# EAGLE design fhd-hdr (EAGLE 9.6.2)
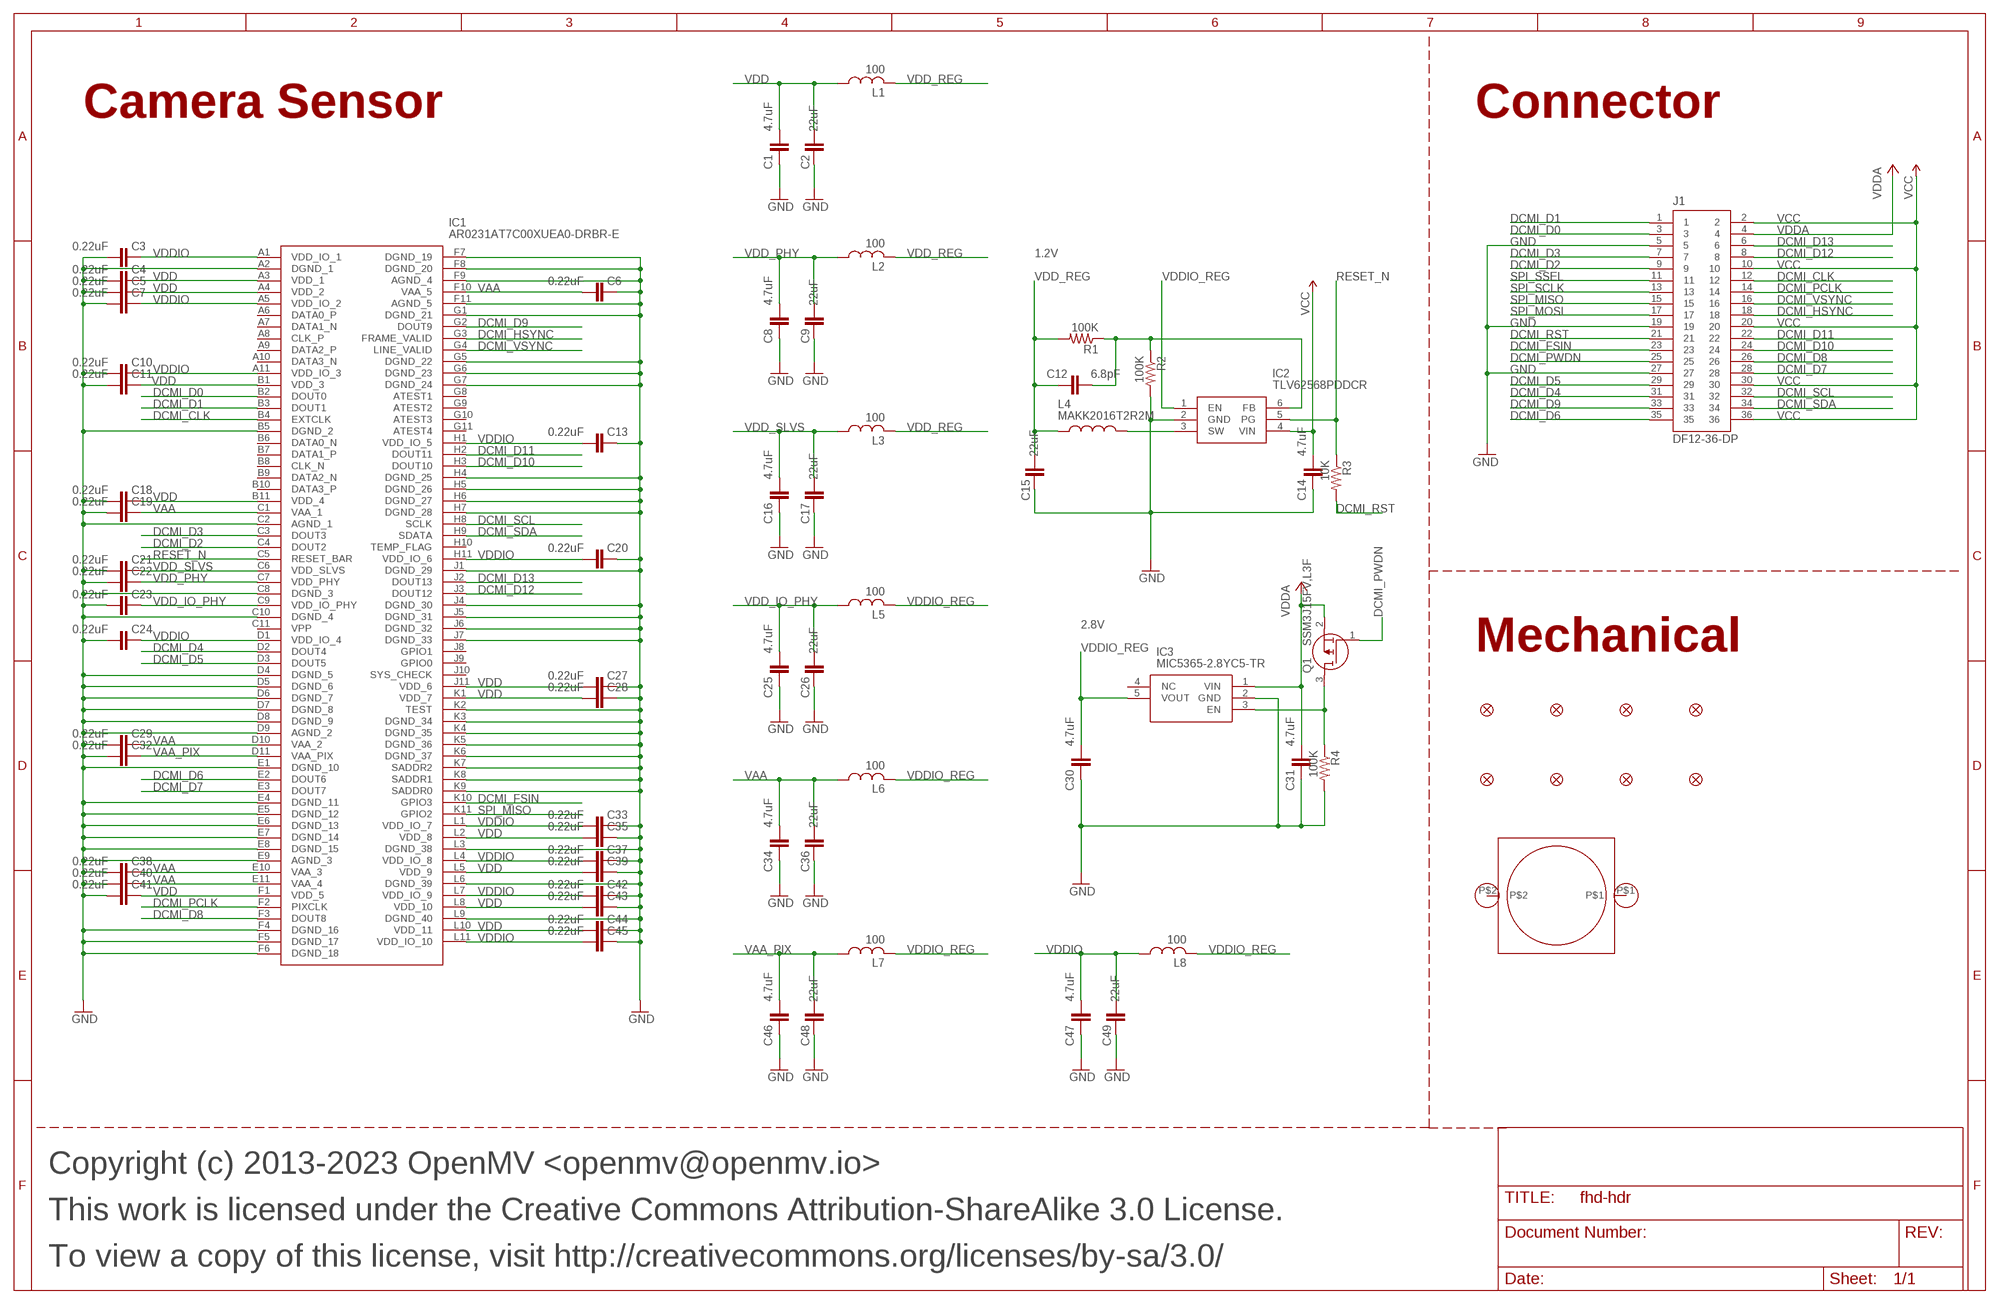
[diagram p0: schematic, sheet 1]

## Parts
C1  4.7uF  CAP_0402  [0402]
C2  22uF  22UF-0805-6.3V-20%  [0805]
C3  0.22uF  C-EUC0201  [C0201]
C4  0.22uF  C-EUC0201  [C0201]
C5  0.22uF  C-EUC0201  [C0201]
C6  0.22uF  C-EUC0201  [C0201]
C7  0.22uF  C-EUC0201  [C0201]
C8  4.7uF  CAP_0402  [0402]
C9  22uF  22UF-0805-6.3V-20%  [0805]
C10  0.22uF  C-EUC0201  [C0201]
C11  0.22uF  C-EUC0201  [C0201]
C12  6.8pF  CAP_0402  [0402]
C13  0.22uF  C-EUC0201  [C0201]
C14  4.7uF  CAP_0402  [0402]
C15  22uF  22UF-0805-6.3V-20%  [0805]
C16  4.7uF  CAP_0402  [0402]
C17  22uF  22UF-0805-6.3V-20%  [0805]
C18  0.22uF  C-EUC0201  [C0201]
C19  0.22uF  C-EUC0201  [C0201]
C20  0.22uF  C-EUC0201  [C0201]
C21  0.22uF  C-EUC0201  [C0201]
C22  0.22uF  C-EUC0201  [C0201]
C23  0.22uF  C-EUC0201  [C0201]
C24  0.22uF  C-EUC0201  [C0201]
C25  4.7uF  CAP_0402  [0402]
C26  22uF  22UF-0805-6.3V-20%  [0805]
C27  0.22uF  C-EUC0201  [C0201]
C28  0.22uF  C-EUC0201  [C0201]
C29  0.22uF  C-EUC0201  [C0201]
C30  4.7uF  CAP_0402  [0402]
C31  4.7uF  CAP_0402  [0402]
C32  0.22uF  C-EUC0201  [C0201]
C33  0.22uF  C-EUC0201  [C0201]
C34  4.7uF  CAP_0402  [0402]
C35  0.22uF  C-EUC0201  [C0201]
C36  22uF  22UF-0805-6.3V-20%  [0805]
C37  0.22uF  C-EUC0201  [C0201]
C38  0.22uF  C-EUC0201  [C0201]
C39  0.22uF  C-EUC0201  [C0201]
C40  0.22uF  C-EUC0201  [C0201]
C41  0.22uF  C-EUC0201  [C0201]
C42  0.22uF  C-EUC0201  [C0201]
C43  0.22uF  C-EUC0201  [C0201]
C44  0.22uF  C-EUC0201  [C0201]
C45  0.22uF  C-EUC0201  [C0201]
C46  4.7uF  CAP_0402  [0402]
C47  4.7uF  CAP_0402  [0402]
C48  22uF  22UF-0805-6.3V-20%  [0805]
C49  22uF  22UF-0805-6.3V-20%  [0805]
FD1  FIDUCIAL1X2  [FIDUCIAL-1X2]
FD2  FIDUCIAL1X2  [FIDUCIAL-1X2]
FD3  FIDUCIAL1X2  [FIDUCIAL-1X2]
FD4  FIDUCIAL1X2  [FIDUCIAL-1X2]
FD5  FIDUCIAL1X2  [FIDUCIAL-1X2]
FD6  FIDUCIAL1X2  [FIDUCIAL-1X2]
FD7  FIDUCIAL1X2  [FIDUCIAL-1X2]
FD8  FIDUCIAL1X2  [FIDUCIAL-1X2]
H1  LENSMOUNT20MM  [LENSMOUNT-20MM]
IC1  AR0231AT7C00XUEA0-DRBR-E  [BGA121C80P11X11_1100X1000X155]
IC2  TLV62568PDDCR  [SOT95P280X110-6N]
IC3  MIC5365-2.8YC5-TR  [SOT65P210X110-5N]
J1  DF12-36-DP  [DF12-36-DP]
L1  100  INDUCTOR_0402  [0402]
L2  100  INDUCTOR_0402  [0402]
L3  100  INDUCTOR_0402  [0402]
L4  MAKK2016T2R2M  [INDC2016X100N]
L5  100  INDUCTOR_0402  [0402]
L6  100  INDUCTOR_0402  [0402]
L7  100  INDUCTOR_0402  [0402]
L8  100  INDUCTOR_0402  [0402]
Q1  SSM3J15FV,L3F  [SSM3J15FVL3F]
R1  100K  R-US_R0402  [R0402]
R2  100K  R-US_R0402  [R0402]
R3  10K  R-US_R0402  [R0402]
R4  100K  R-US_R0402  [R0402]

## Nets
DCMI_CLK [signal]: IC1.B4(EXTCLK) J1.12
DCMI_D0 [signal]: IC1.B2(DOUT0) J1.3
DCMI_D1 [signal]: IC1.B3(DOUT1) J1.1
DCMI_D2 [signal]: IC1.C4(DOUT2) J1.9
DCMI_D3 [signal]: IC1.C3(DOUT3) J1.7
DCMI_D4 [signal]: IC1.D2(DOUT4) J1.31
DCMI_D5 [signal]: IC1.D3(DOUT5) J1.29
DCMI_D6 [signal]: IC1.E2(DOUT6) J1.35
DCMI_D7 [signal]: IC1.E3(DOUT7) J1.28
DCMI_D8 [signal]: IC1.F3(DOUT8) J1.26
DCMI_D9 [signal]: IC1.G2(DOUT9) J1.33
DCMI_D10 [signal]: IC1.H3(DOUT10) J1.24
DCMI_D11 [signal]: IC1.H2(DOUT11) J1.22
DCMI_D12 [signal]: IC1.J3(DOUT12) J1.8
DCMI_D13 [signal]: IC1.J2(DOUT13) J1.6
DCMI_FSIN [signal]: IC1.K10(GPIO3) J1.23
DCMI_HSYNC [signal]: IC1.G3(FRAME_VALID) J1.18
DCMI_PCLK [signal]: IC1.F2(PIXCLK) J1.14
DCMI_PWDN [signal]: J1.25 Q1.1(G)
DCMI_PWDN_INT [signal]: IC3.3(EN) Q1.3(D) R4.1
DCMI_RST [signal]: J1.21 R3.2
DCMI_SCL [signal]: IC1.H8(SCLK) J1.32
DCMI_SDA [signal]: IC1.H9(SDATA) J1.34
DCMI_VSYNC [signal]: IC1.G4(LINE_VALID) J1.16
FB [pwr]: C12.2 IC2.6(FB) R1.1 R2.1
GND [gnd]: C1.1 C2.1 C3.2 C4.2 C5.2 C6.1 C7.2 C8.1 C9.1 C10.2 C11.2 C13.1 C14.1 C15.1 C16.1 C17.1 C18.2 C19.2 C20.1 C21.2 C22.2 C23.2 C24.2 C25.1 C26.1 C27.1 C28.1 C29.2 C30.1 C31.1 C32.2 C33.1 C34.1 C35.1 C36.1 C37.1 C38.2 C39.1 C40.2 C41.2 C42.1 C43.1 C44.1 C45.1 C46.1 C47.1 C48.1 C49.1 IC1.A2(DGND_1) IC1.B5(DGND_2) IC1.C2(AGND_1) IC1.C8(DGND_3) IC1.C10(DGND_4) IC1.D4(DGND_5) IC1.D5(DGND_6) IC1.D6(DGND_7) IC1.D7(DGND_8) IC1.D8(DGND_9) IC1.D9(AGND_2) IC1.E1(DGND_10) IC1.E4(DGND_11) IC1.E5(DGND_12) IC1.E6(DGND_13) IC1.E7(DGND_14) IC1.E8(DGND_15) IC1.E9(AGND_3) IC1.F4(DGND_16) IC1.F5(DGND_17) IC1.F6(DGND_18) IC1.F7(DGND_19) IC1.F8(DGND_20) IC1.F9(AGND_4) IC1.F11(AGND_5) IC1.G1(DGND_21) IC1.G5(DGND_22) IC1.G6(DGND_23) IC1.G7(DGND_24) IC1.H4(DGND_25) IC1.H5(DGND_26) IC1.H6(DGND_27) IC1.H7(DGND_28) IC1.J1(DGND_29) IC1.J4(DGND_30) IC1.J5(DGND_31) IC1.J6(DGND_32) IC1.J7(DGND_33) IC1.K2(TEST) IC1.K3(DGND_34) IC1.K4(DGND_35) IC1.K5(DGND_36) IC1.K6(DGND_37) IC1.K7(SADDR2) IC1.K8(SADDR1) IC1.K9(SADDR0) IC1.L3(DGND_38) IC1.L6(DGND_39) IC1.L9(DGND_40) IC2.2(GND) IC3.2(GND) J1.5 J1.19 J1.27 R2.2 R4.2
RESET_N [signal]: IC1.C5(RESET_BAR) IC2.5(PG) R3.1
SPI_MISO [signal]: IC1.K11(GPIO2) J1.15
SPI_MOSI [signal]: J1.17
SPI_SCLK [signal]: J1.13
SPI_SSEL [signal]: J1.11
SW [pwr]: IC2.3(SW) L4.2
VAA [pwr]: C6.2 C19.1 C29.1 C34.2 C36.2 C38.1 C40.1 IC1.C1(VAA_1) IC1.D10(VAA_2) IC1.E10(VAA_3) IC1.E11(VAA_4) IC1.F10(VAA_5) L6.1
VAA_PIX [pwr]: C32.1 C46.2 C48.2 IC1.D11(VAA_PIX) L7.1
VCC [pwr]: C14.2 IC2.4(VIN) J1.2 J1.10 J1.20 J1.30 J1.36
VDD [pwr]: C1.2 C2.2 C4.1 C5.1 C11.1 C18.1 C27.2 C28.2 C35.2 C39.2 C41.1 C43.2 C44.2 IC1.A3(VDD_1) IC1.A4(VDD_2) IC1.B1(VDD_3) IC1.B11(VDD_4) IC1.F1(VDD_5) IC1.J11(VDD_6) IC1.K1(VDD_7) IC1.L2(VDD_8) IC1.L5(VDD_9) IC1.L8(VDD_10) IC1.L10(VDD_11) L1.1
VDD_IO_PHY [pwr]: C23.1 C25.2 C26.2 IC1.C9(VDD_IO_PHY) L5.1
VDD_PHY [pwr]: C8.2 C9.2 C22.1 IC1.C7(VDD_PHY) L2.1
VDD_REG [pwr]: C12.1 C15.2 L1.2 L2.2 L3.2 L4.1 R1.2
VDD_SLVS [pwr]: C16.2 C17.2 C21.1 IC1.C6(VDD_SLVS) L3.1
VDDA [pwr]: C31.2 IC3.1(VIN) J1.4 Q1.2(S)
VDDIO [pwr]: C3.1 C7.1 C10.1 C13.2 C20.2 C24.1 C33.2 C37.2 C42.2 C45.2 C47.2 C49.2 IC1.A1(VDD_IO_1) IC1.A5(VDD_IO_2) IC1.A11(VDD_IO_3) IC1.D1(VDD_IO_4) IC1.H1(VDD_IO_5) IC1.H11(VDD_IO_6) IC1.L1(VDD_IO_7) IC1.L4(VDD_IO_8) IC1.L7(VDD_IO_9) IC1.L11(VDD_IO_10) L8.1
VDDIO_REG [pwr]: C30.2 IC2.1(EN) IC3.5(VOUT) L5.2 L6.2 L7.2 L8.2
Unconnected: H1.P$1 H1.P$2 IC1.A6(DATA0_P) IC1.A7(DATA1_N) IC1.A8(CLK_P) IC1.A9(DATA2_P) IC1.A10(DATA3_N) IC1.B6(DATA0_N) IC1.B7(DATA1_P) IC1.B8(CLK_N) IC1.B9(DATA2_N) IC1.B10(DATA3_P) IC1.C11(VPP) IC1.G8(ATEST1) IC1.G9(ATEST2) IC1.G10(ATEST3) IC1.G11(ATEST4) IC1.H10(TEMP_FLAG) IC1.J8(GPIO1) IC1.J9(GPIO0) IC1.J10(SYS_CHECK) IC3.4(NC)

## Notes on the sheet
- Camera Sensor | Connector
- 1.2V
- 2.8V
- Mechanical
- Copyright (c) 2013-2023 OpenMV <openmv@openmv.io>
- This work is licensed under the Creative Commons Attribution-ShareAlike 3.0 License.
- To view a copy of this license, visit http://creativecommons.org/licenses/by-sa/3.0/

## Library data of the parts
C1 C8 C14 C16 C25 C30 C31 C34 C46 C47 = 0402:CAP_0402: 0402 (1005 Metric) Nick Garner - TeleSense; MPN: JMK105BBJ475MV-F
C2 C9 C15 C17 C26 C36 C48 C49 = SparkFun-Capacitors:22UF: 22µF ceramic capacitors A capacitor is a passive two-terminal electrical component used to store electrical energy temporarily in an electric field.; MPN: CL21A226MQQNNNE; PROD_ID: CAP-08402
C3-C7 C10 C11 C13 C18-C24 C27-C29 C32 C33 C35 C37-C45 = rcl:C-EU: CAPACITOR, European symbol; MPN: GRM033R60J224ME15D; SPICEPREFIX: C
C12 = 0402:CAP_0402: 0402 (1005 Metric) Nick Garner - TeleSense; MPN: GRM1555C1H6R8DA01D
FD1-FD8 = SparkFun-Aesthetics:FIDUCIAL: Fiducial Alignment Points Point-of-reference for pick-and-place machines and other optical instruments.
H1 = lensmount:LENSMOUNT
IC1 = AR0231AT7C00XUEA0-DRBR-E:AR0231AT7C00XUEA0-DRBR-E: Image Sensor Color CMOS 1928 x 1208Pixels Source: Datasheet <https://4donline.ihs.com/images/VipMasterIC/IC/ONSM/ONSM-S-A0003590094/ONSM-S-A0003590376-1.pdf?hkey=52A5661711E402568146F3353EA87419>; DESCRIPTION: Image Sensor Color CMOS 1928 x 1208Pixels; HEIGHT: 1.55mm; MANUFACTURER_NAME: onsemi; MANUFACTURER_PART_NUMBER: AR0231AT7C00XUEA0-DRBR-E; MPN: AR0231AT7C00XUEA0-DPBR
IC2 = TLV62568PDDCR:TLV62568PDDCR: 2.5V-5.5V input, 1A high efficiency step-down buck converter in SOT23 and SOT563 package Source: Datasheet <http://www.ti.com/lit/gpn/tlv62568>; DESCRIPTION: 2.5V-5.5V input, 1A high efficiency step-down buck converter in SOT23 and SOT563 package; HEIGHT: 1.1mm; MANUFACTURER_NAME: Texas Instruments; MANUFACTURER_PART_NUMBER: TLV62568PDDCR; MOUSER_PART_NUMBER: 595-TLV62568PDDCR; MOUSER_PRICE-STOCK: https://www.mouser.co.uk/ProductDetail/Texas-Instruments/TLV62568PDDCR?qs=1mbolxNpo8f1FPchIXcxyQ%3D%3D; MPN: TLV62568PDDCR
IC3 = MIC5365-2.8YC5-TR:MIC5365-2.8YC5-TR: IC REG LINEAR 2.8V 150MA SC70-5 Source: Datasheet <http://www.microchip.com/mymicrochip/filehandler.aspx?ddocname=en580022>; DESCRIPTION: IC REG LINEAR 2.8V 150MA SC70-5; HEIGHT: 1.1mm; MANUFACTURER_NAME: Microchip; MANUFACTURER_PART_NUMBER: MIC5365-2.8YC5-TR; MOUSER_PART_NUMBER: 998-MIC5365-2.8YC5TR; MOUSER_PRICE-STOCK: https://www.mouser.co.uk/ProductDetail/Microchip-Technology-Atmel/MIC5365-2.8YC5-TR?qs=U6T8BxXiZAX3mJDSWJyjVA%3D%3D; MPN: MIC5365-2.8YC5-TR
J1 = DF12NB(3.0)-36DP-0.5V(51):DF12-36-DP; MPN: DF12NB(3.0)-36DP-0.5V(51)
L1-L3 L5-L8 = 0402:INDUCTOR_0402; MPN: MFBM1V1005-101-R
L4 = MAKK2016T2R2M:MAKK2016T2R2M: INDUCTOR, METAL CORE Check availability <https://pricing.snapeda.com/parts/MAKK2016T2R2M/Taiyo%20Yuden/view-part?ref=eda>; AVAILABILITY: In Stock; DESCRIPTION: 2.2 µH Shielded Drum Core, Wirewound Inductor 1.5 A 160mOhm Max 0806 (2016 Metric); MF: Taiyo Yuden; MP: MAKK2016T2R2M; MPN: MAKK2016T2R2M; PACKAGE: 2016 Taiyo Yuden; PRICE: None; PURCHASE-URL: https://pricing.snapeda.com/search/part/MAKK2016T2R2M/?ref=eda
Q1 = SSM3J15FV_L3F:SSM3J15FV,L3F: MOSFET Small-signal MOSFET High Speed Switching Source: Datasheet <https://toshiba.semicon-storage.com/info/docget.jsp?did=593&prodName=SSM3J15FV>; DESCRIPTION: MOSFET Small-signal MOSFET High Speed Switching; HEIGHT: 0.55mm; MANUFACTURER_NAME: Toshiba; MANUFACTURER_PART_NUMBER: SSM3J15FV,L3F; MOUSER_PART_NUMBER: 757-SSM3J15FVL3F; MOUSER_PRICE-STOCK: https://www.mouser.co.uk/ProductDetail/Toshiba/SSM3J15FVL3F?qs=PDgMCp4xDJb4qTgE7FAUzA%3D%3D; MPN: SSM3J15FV,L3F
R1 R2 R4 = rcl:R-US_: RESISTOR, American symbol; MPN: AC0402FR-07100KL; SPICEPREFIX: R
R3 = rcl:R-US_: RESISTOR, American symbol; MPN: AC0402FR-1310KL; SPICEPREFIX: R

## Net classes
0 default: width 0.076 mm, drill 0.102 mm, clearance 0.076 mm
2 gnd: width 0.076 mm, drill 0.102 mm, clearance 0.076 mm to class 0, clearance 0.076 mm to class 1, clearance 0.127 mm
3 pwr: width 0.076 mm, drill 0.102 mm, clearance 0.076 mm to class 0, clearance 0.076 mm to class 1, clearance 0.076 mm to class 2, clearance 0.127 mm
4 signal: width 0.076 mm, drill 0.102 mm, clearance 0.076 mm to class 0, clearance 0.076 mm to class 1, clearance 0.076 mm to class 2, clearance 0.076 mm to class 3, clearance 0.127 mm

## Board
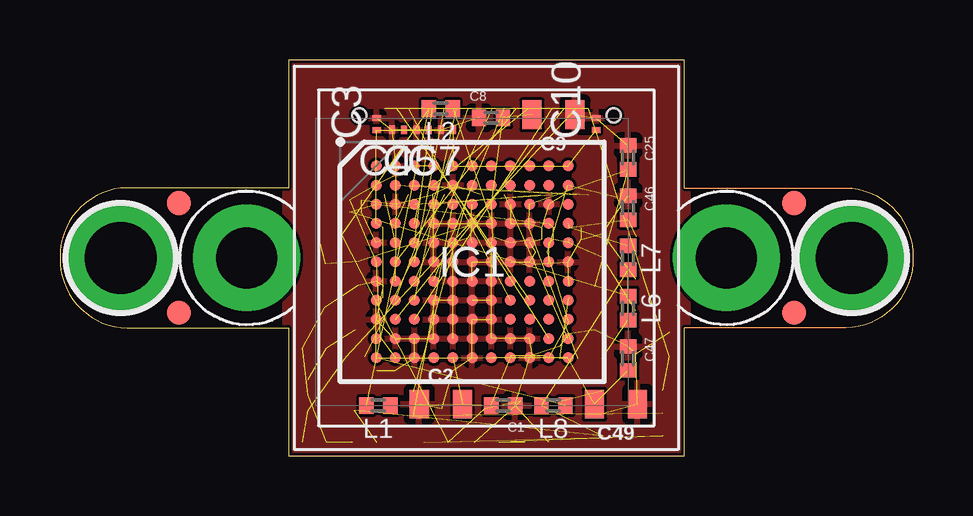
[diagram p1: board, top side]
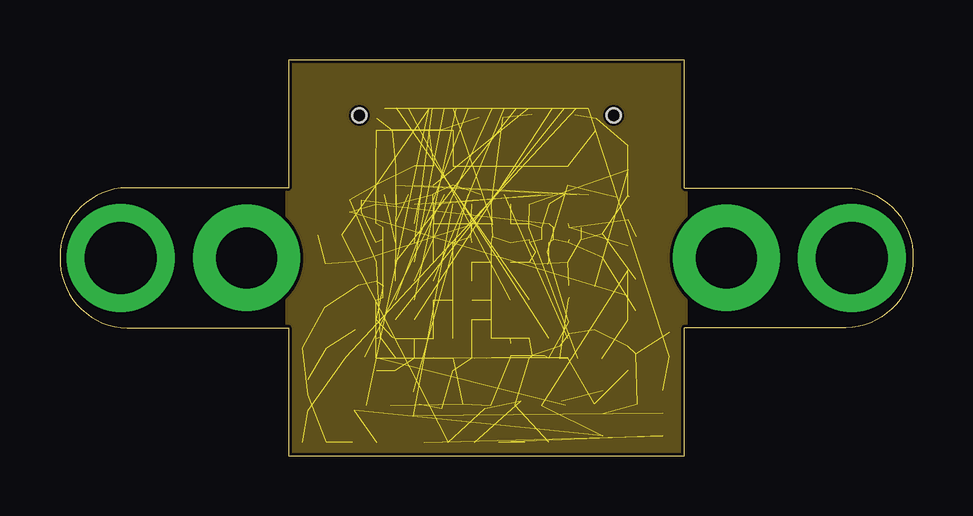
[diagram p2: board, inner layer GND]
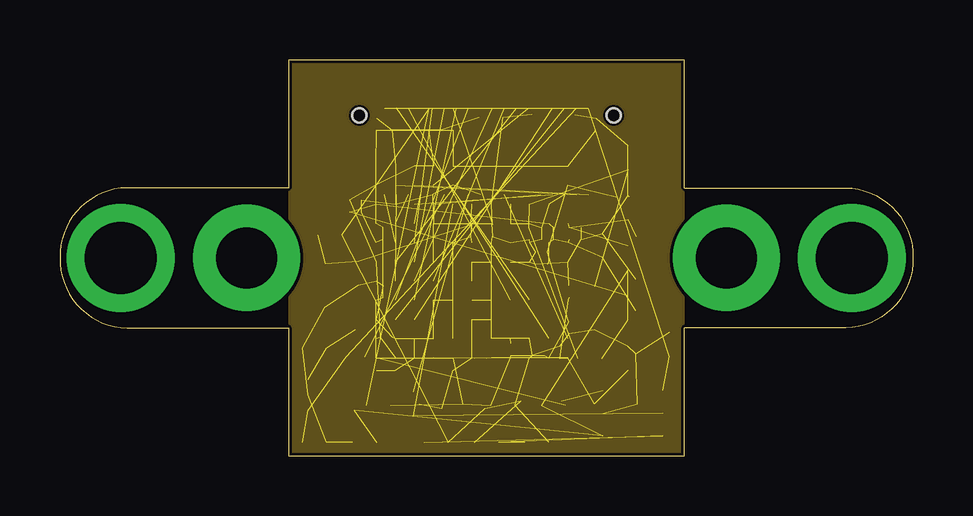
[diagram p3: board, inner layer VCC]
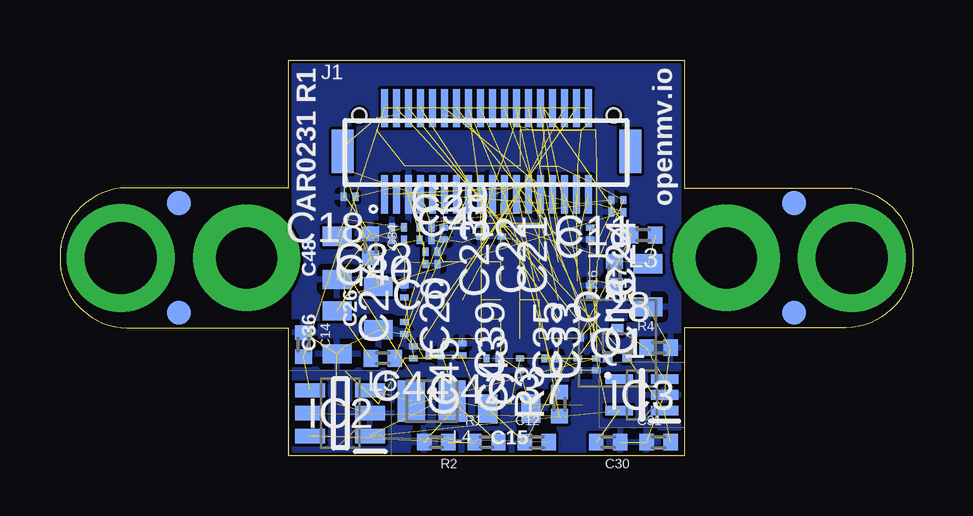
[diagram p4: board, bottom side, seen from below]

Size 35.56 x 16.51 mm. Coordinates in mm from the lower left corner, seen from the top.
Outline: 9.53,16.51 9.53,11.18 2.79,11.18 arc90 0,8.26 arc90 2.79,5.33 9.53,5.33 9.53,0 26.04,0 26.04,5.33 32.77,5.33 arc90 35.56,8.26 arc90 32.77,11.18 26.04,11.18 26.04,16.51 9.53,16.51
Copper layers (1*2*3*14*15*16): Top 0.035mm / dielectric 0.23mm / GND 0.035mm / dielectric 0.38mm / Route3 0.035mm / dielectric 0.15mm / Route14 0.035mm / dielectric 0.38mm / VCC 0.035mm / dielectric 0.23mm / Bottom 0.035mm
Design rules "MF_Ext_4_mil_drill_6_Layer": minimum track width 3mil, minimum drill 4mil, track to track 3mil, track to pad 3mil, pad to pad 3mil, via to via 3mil, smd to smd 0mil, copper to edge 3mil, drill to drill 3mil, minimum pad ring 3mil, minimum via ring 3mil, stop-mask expansion 2mil, vias tented up to drill 25mil, thermal gap 10mil
tKeepout: area 9.5,15.3 to 26,16.5; area 9.5,0 to 10.7,16.5; area 9.5,0 to 26,1.2; area 24.8,0 to 26,16.5

### Footprints (pad centres in the part's own frame; a part is rotated, then mirrored left to right if it is on the bottom)
0402 = smd 0.6 x 0.7: 1 -0.5,0; 2 0.5,0
0805 = smd 0.8 x 1.2: 1 -0.9,0; 2 0.9,0
C0201 = smd 0.25 x 0.35: 1 -0.25,0; 2 0.25,0
FIDUCIAL-1X2 = smd 1 x 1: 1 0,0
LENSMOUNT-20MM = drill 2.54 pad 4.445: P$1 -10,0; P$2 10,0
BGA121C80P11X11_1100X1000X155 = smd 0.45 x 0.45: A1 -4,4; A2 -3.2,4; A3 -2.4,4; A4 -1.6,4; A5 -0.8,4; A6 0,4; A7 0.8,4; A8 1.6,4; A9 2.4,4; A10 3.2,4; A11 4,4; B1 -4,3.2; B2 -3.2,3.2; B3 -2.4,3.2; B4 -1.6,3.2; B5 -0.8,3.2; B6 0,3.2; B7 0.8,3.2; B8 1.6,3.2; B9 2.4,3.2; B10 3.2,3.2; B11 4,3.2; C1 -4,2.4; C2 -3.2,2.4; C3 -2.4,2.4; C4 -1.6,2.4; C5 -0.8,2.4; C6 0,2.4; C7 0.8,2.4; C8 1.6,2.4; C9 2.4,2.4; C10 3.2,2.4; C11 4,2.4; D1 -4,1.6; D2 -3.2,1.6; D3 -2.4,1.6; D4 -1.6,1.6; D5 -0.8,1.6; D6 0,1.6; D7 0.8,1.6; D8 1.6,1.6; D9 2.4,1.6; D10 3.2,1.6; D11 4,1.6; E1 -4,0.8; E2 -3.2,0.8; E3 -2.4,0.8; E4 -1.6,0.8; E5 -0.8,0.8; E6 0,0.8; E7 0.8,0.8; E8 1.6,0.8; E9 2.4,0.8; E10 3.2,0.8; E11 4,0.8; F1 -4,0; F2 -3.2,0; F3 -2.4,0; F4 -1.6,0; F5 -0.8,0; F6 0,0; F7 0.8,0; F8 1.6,0; F9 2.4,0; F10 3.2,0; F11 4,0; G1 -4,-0.8; G2 -3.2,-0.8; G3 -2.4,-0.8; G4 -1.6,-0.8; G5 -0.8,-0.8; G6 0,-0.8; G7 0.8,-0.8; G8 1.6,-0.8; G9 2.4,-0.8; G10 3.2,-0.8; G11 4,-0.8; H1 -4,-1.6; H2 -3.2,-1.6; H3 -2.4,-1.6; H4 -1.6,-1.6; H5 -0.8,-1.6; H6 0,-1.6; H7 0.8,-1.6; H8 1.6,-1.6; H9 2.4,-1.6; H10 3.2,-1.6; H11 4,-1.6; J1 -4,-2.4; J2 -3.2,-2.4; J3 -2.4,-2.4; J4 -1.6,-2.4; J5 -0.8,-2.4; J6 0,-2.4; J7 0.8,-2.4; J8 1.6,-2.4; J9 2.4,-2.4; J10 3.2,-2.4; J11 4,-2.4; K1 -4,-3.2; K2 -3.2,-3.2; K3 -2.4,-3.2; K4 -1.6,-3.2; K5 -0.8,-3.2; K6 0,-3.2; K7 0.8,-3.2; K8 1.6,-3.2; K9 2.4,-3.2; K10 3.2,-3.2; K11 4,-3.2; L1 -4,-4; L2 -3.2,-4; L3 -2.4,-4; L4 -1.6,-4; L5 -0.8,-4; L6 0,-4; L7 0.8,-4; L8 1.6,-4; L9 2.4,-4; L10 3.2,-4; L11 4,-4
SOT95P280X110-6N = smd 1.25 x 0.6: 1 -1.25,0.95; 2 -1.25,0; 3 -1.25,-0.95; 4 1.25,-0.95; 5 1.25,0; 6 1.25,0.95
SOT65P210X110-5N = smd 1.15 x 0.4: 1 -0.95,0.65; 2 -0.95,0; 3 -0.95,-0.65; 4 0.95,-0.65; 5 0.95,0.65
DF12-36-DP = smd 0.3 x 1.6: 1 -4.25,-1.8; 2 -4.25,1.8; 3 -3.75,-1.8; 4 -3.75,1.8; 5 -3.25,-1.8; 6 -3.25,1.8; 7 -2.75,-1.8; 8 -2.75,1.8; 9 -2.25,-1.8; 10 -2.25,1.8; 11 -1.75,-1.8; 12 -1.75,1.8; 13 -1.25,-1.8; 14 -1.25,1.8; 15 -0.75,-1.8; 16 -0.75,1.8; 17 -0.25,-1.8; 18 -0.25,1.8; 19 0.25,-1.8; 20 0.25,1.8; 21 0.75,-1.8; 22 0.75,1.8; 23 1.25,-1.8; 24 1.25,1.8; 25 1.75,-1.8; 26 1.75,1.8; 27 2.25,-1.8; 28 2.25,1.8; 29 2.75,-1.8; 30 2.75,1.8; 31 3.25,-1.8; 32 3.25,1.8; 33 3.75,-1.8; 34 3.75,1.8; 35 4.25,-1.8; 36 4.25,1.8 | smd 0.9 x 1.8: F1 -6,0; F2 6,0 | hole 0.6: -5.3,1.5; 5.3,1.5
INDC2016X100N = smd 1.14 x 1.73: 1 -0.847,0; 2 0.847,0
SSM3J15FVL3F = smd 0.4 x 0.45: 1 -0.4,-0.575; 2 0.4,-0.575 | smd 0.5 x 0.45: 3 0,0.575
R0402 = smd 0.6 x 0.7: 1 -0.5,0; 2 0.5,0

### Placement (x,y rotation side)
C1  18.48,2.1 180 top
C2  15.88,2.16 0 top
C3  13.21,13.84 90 top
C4  14.1,13.59 180 top
C5  15.11,13.59 180 top
C6  20.07,8 180 bottom
C7  16.13,13.59 180 top
C8  17.97,14.1 0 top
C9  20.57,14.22 180 top
C10  22.35,13.84 90 top
C11  12.32,10.67 180 bottom
C12  15.68,0.57 0 bottom
C13  13.46,6.86 270 bottom
C14  25.4,4.64 270 bottom
C15  16.83,1.97 180 bottom
C16  12.45,7.62 90 bottom
C17  11.05,7.11 90 bottom
C18  23.5,10.79 180 bottom
C19  12.32,10.16 180 bottom
C20  21.21,6.86 270 bottom
C21  17.14,9.4 270 bottom
C22  18.03,9.4 270 bottom
C23  19.56,9.27 270 bottom
C24  13.46,9.27 270 bottom
C25  23.69,12.45 270 top
C26  22.29,6.16 90 bottom
C27  21.21,5.33 90 bottom
C28  13.59,4.95 0 bottom
C29  20.32,9.53 0 bottom
C30  12.7,0.57 180 bottom
C31  10.6,0.57 0 bottom
C32  21.46,9.53 180 bottom
C33  13.21,3.81 90 bottom
C34  22.61,8.76 270 bottom
C35  13.97,3.81 90 bottom
C36  24,5.14 90 bottom
C37  15.11,4.06 180 bottom
C38  20.32,9.02 0 bottom
C39  16.38,3.81 90 bottom
C40  21.46,9.02 180 bottom
C41  20.07,8.51 0 bottom
C42  17.53,4.06 180 bottom
C43  18.8,4.45 270 bottom
C44  19.94,4.19 180 bottom
C45  20.83,4.32 270 bottom
C46  23.69,10.35 270 top
C47  23.69,4.06 270 top
C48  24,8.26 90 bottom
C49  23.18,2.16 180 top
FD1  30.61,5.97 0 top
FD2  30.61,10.54 0 top
FD3  30.61,10.54 0 bottom
FD4  30.61,5.97 0 bottom
FD5  4.95,5.97 0 top
FD6  4.95,10.54 0 top
FD7  4.95,10.54 0 bottom
FD8  4.95,5.97 0 bottom
H1  17.78,8.26 0 top
IC1  17.18,8.09 0 top
IC2  23.88,1.78 180 bottom
IC3  11.3,2.54 180 bottom
J1  17.78,12.7 0 bottom
L1  13.27,2.1 180 top
L2  15.88,14.48 180 top
L3  11.24,9.21 180 bottom
L4  20.07,2.29 180 bottom
L5  22.1,4.06 180 bottom
L6  23.69,6.16 270 top
L7  23.69,8.26 270 top
L8  20.57,2.1 180 top
Q1  12.32,4.7 0 bottom
R1  17.78,0.57 0 bottom
R2  19.88,0.57 180 bottom
R3  14.73,2.16 90 bottom
R4  10.6,4.51 0 bottom

### Tracks (layer width: path | path; a pad name or v marks a point on that pad's centre or on a via)
DCMI_CLK  (1 unrouted)
DCMI_D0  (1 unrouted)
DCMI_D1  (1 unrouted)
DCMI_D2  (1 unrouted)
DCMI_D3  (1 unrouted)
  Bottom 0.152: J1.7 20.57,10.86
DCMI_D4  (1 unrouted)
DCMI_D5  (1 unrouted)
DCMI_D6  (1 unrouted)
DCMI_D7  (1 unrouted)
DCMI_D8  (1 unrouted)
DCMI_D9  (1 unrouted)
DCMI_D10  (1 unrouted)
DCMI_D11  (1 unrouted)
DCMI_D12  (1 unrouted)
DCMI_D13  (1 unrouted)
DCMI_FSIN  (1 unrouted)
DCMI_HSYNC  (1 unrouted)
DCMI_PCLK  (1 unrouted)
DCMI_PWDN  (1 unrouted)
DCMI_PWDN_INT  (2 unrouted)
DCMI_RST  (1 unrouted)
DCMI_SCL  (1 unrouted)
DCMI_SDA  (1 unrouted)
DCMI_VSYNC  (1 unrouted)
FB  (3 unrouted)
GND  (103 unrouted)
  pour GND (isolate 0.127): 9.53,0 9.53,16.51 26.04,16.51 26.04,0
  pour Top (isolate 0.127): 9.4,-0.13 9.4,16.64 26.16,16.64 26.16,-0.13
  pour Bottom (isolate 0.127): 9.78,0.25 9.78,16.26 25.78,16.26 25.78,0.25
N$3  (via drill 3 pad 4.5)
  other vias: 2.54,8.26
N$4  (via drill 3 pad 4.5)
  other vias: 33.02,8.26
RESET_N  (2 unrouted)
SPI_MISO  (1 unrouted)
SW  (1 unrouted)
VAA  (12 unrouted)
VAA_PIX  (4 unrouted)
VCC  (6 unrouted)
  Bottom 0.254: J1.20
  pour VCC (isolate 0.127): 9.65,0.13 9.65,16.38 25.91,16.38 25.91,0.13
VDD  (24 unrouted)
VDD_IO_PHY  (4 unrouted)
VDD_PHY  (4 unrouted)
VDD_REG  (6 unrouted)
VDD_SLVS  (4 unrouted)
VDDA  (3 unrouted)
VDDIO  (22 unrouted)
VDDIO_REG  (6 unrouted)

### Text on the board
bPlace: openmv.io | AR0231 R1